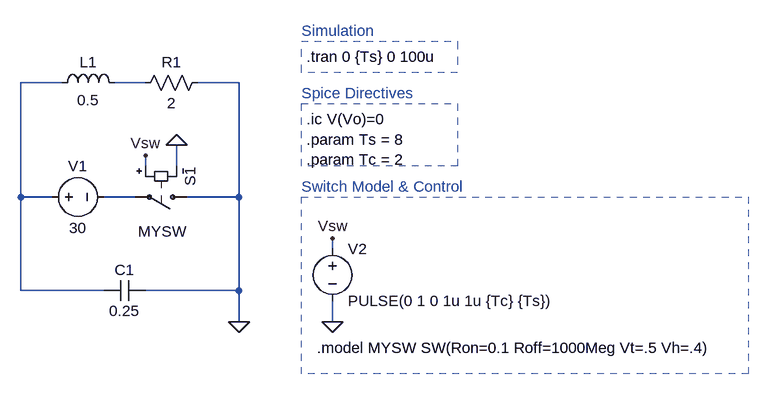
[diagram p0: schematic Example_1_RLC.asc]
Example_1_RLC.asc, the LTspice schematic file:
Version 4
SHEET 1 1532 760
WIRE 272 128 208 128
WIRE 400 128 352 128
WIRE 544 128 480 128
WIRE 400 256 400 240
WIRE 448 256 448 224
WIRE 208 304 208 128
WIRE 256 304 208 304
WIRE 384 304 336 304
WIRE 544 304 544 128
WIRE 544 304 464 304
WIRE 688 384 688 368
WIRE 208 448 208 304
WIRE 336 448 208 448
WIRE 544 448 544 304
WIRE 544 448 400 448
WIRE 544 496 544 448
WIRE 688 496 688 464
FLAG 448 224 0
FLAG 400 240 Vsw
FLAG 688 368 Vsw
FLAG 688 496 0
FLAG 544 496 0
SYMBOL voltage 240 304 R270
WINDOW 0 32 56 VTop 2
WINDOW 3 -32 56 VBottom 2
SYMATTR InstName V1
SYMATTR Value 30
SYMBOL sw 480 304 R90
WINDOW 0 -46 11 Left 2
WINDOW 3 53 17 VRight 2
SYMATTR InstName S1
SYMATTR Value MYSW
SYMBOL voltage 688 368 R0
WINDOW 123 0 0 Left 0
WINDOW 39 0 0 Left 0
SYMATTR InstName V2
SYMATTR Value PULSE(0 1 0 1u 1u {Tc} {Ts})
SYMBOL cap 400 432 R90
WINDOW 0 0 32 VBottom 2
WINDOW 3 32 32 VTop 2
SYMATTR InstName C1
SYMATTR Value 0.25
SYMBOL res 496 112 R90
WINDOW 0 0 56 VBottom 2
WINDOW 3 32 56 VTop 2
SYMATTR InstName R1
SYMATTR Value 2
SYMBOL ind 256 144 R270
WINDOW 0 32 56 VTop 2
WINDOW 3 5 56 VBottom 2
SYMATTR InstName L1
SYMATTR Value 0.5
TEXT 640 48 Left 2 ;Simulation
TEXT 648 88 Left 2 !.tran 0 {Ts} 0 100u
TEXT 640 144 Left 2 ;Spice Directives
TEXT 664 536 Left 2 !.model MYSW SW(Ron=0.1 Roff=1000Meg Vt=.5 Vh=.4)
TEXT 648 184 Left 2 !.ic V(Vo)=0\n.param Ts = 8\n.param Tc = 2
TEXT 640 288 Left 2 ;Switch Model & Control
RECTANGLE Normal 880 112 640 64 2
RECTANGLE Normal 1328 576 640 304 2
RECTANGLE Normal 880 256 640 160 2

The netlist it stands for:
* Example_1_RLC.asc
V1 N001 N003 30
S1 0 N003 Vsw 0 MYSW
V2 Vsw 0 PULSE(0 1 0 1u 1u {Tc} {Ts})
C1 0 N001 0.25
R1 0 N002 2
L1 N001 N002 0.5
* Simulation
.tran 0 {Ts} 0 100u
* Spice Directives
.model MYSW SW(Ron=0.1 Roff=1000Meg Vt=.5 Vh=.4)
.ic V(Vo)=0
.param Ts = 8
.param Tc = 2
* Switch Model & Control
.backanno
.end